# Altium schematic sheet POWER.SchDoc
size A4
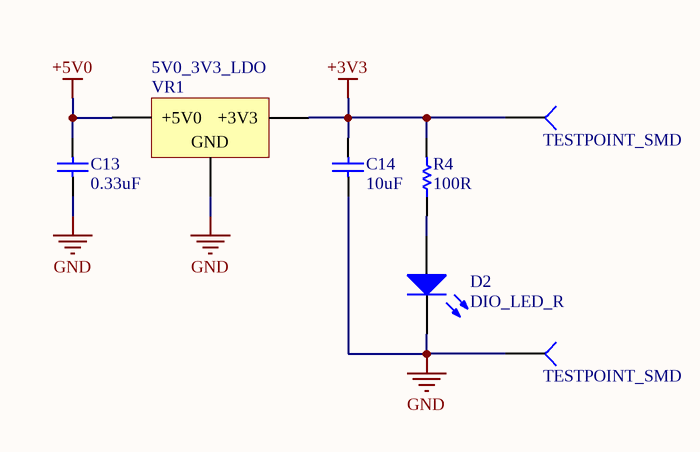
[diagram p0: POWER.SchDoc]

## Parts
C13  value 0.33uF  [CAPC0603(1608)55_N]  (hidden comment: CAP_0.33uF_16V_0603)
C14  value 10uF  [CAPC0603(1608)55_N]  (hidden comment: CAP_10uF_0603)
D2  DIO_LED_R  [LED_0805]
R4  value 100R  [RESC0603(1608)_N]  (hidden comment: RES_100R_0603)
TP3  TESTPOINT_SMD  [TESTPOINT]
TP4  TESTPOINT_SMD  [TESTPOINT]
VR1  5V0_3V3_LDO  [VOLTAGE_REGULATOR]

## Nets
+3V3: C14.2 R4.2 TP3.1(=value) VR1.3(+3V3)
+5V0: C13.2 VR1.1(+5V0)
GND: C13.1 C14.1 D2.2(K) TP4.1(=value) VR1.2(GND)
NetD2_1: D2.1(A) R4.1

## Library data of the parts
C13 = CAP_0.33uF_16V_0603: CAP CER 0.33UF 16V X7R 0603; Part Number: GRM188R71C334KA01D; Manufacturer: Murata Electronics North America; Dimensions: 0.063" L x 0.031" W (1.60mm x 0.80mm); Package: 0603 (1608 Metric); Temperature Coefficient: X7R; Voltage Rating: 16V
C14 = CAP_10uF_0603: CAP CER 10UF 10V X5R 0603; Part Number: CC0603MRX5R6BB106; Manufacturer: Yageo; Dimensions: 0.063" L x 0.031" W (1.60mm x 0.80mm); Package: 0603 (1608 Metric); Temperature Coefficient: X5R; Voltage Rating: 10V
D2 = DIO_LED_R: LED RED DIFFUSED 0805 SMD; Part Number: LS R976-NR-1; Manufacturer: OSRAM; Forward Voltage Drop: 2V; Package: 0805 (2012 Metric)
R4 = RES_100R_0603: RES SMD 100 OHM 1% 1/10W 0603; Manufacturer: Yageo; Part Number (MPN): RC0603FR-07100RL; Package: 0603 (1608 Metric); Dimensions: 0.063" L x 0.031" W (1.60mm x 0.80mm); Tolerance: 1%
VR1 = 5V0_3V3_LDO: IC REG LINEAR 3.3V 1A DPAK; Part Number: NCP1117DT33T5G; Manufacturer: ON Semiconductor; Current Output: 1A